# Altium schematic sheet Sheet1.SchDoc
size A4
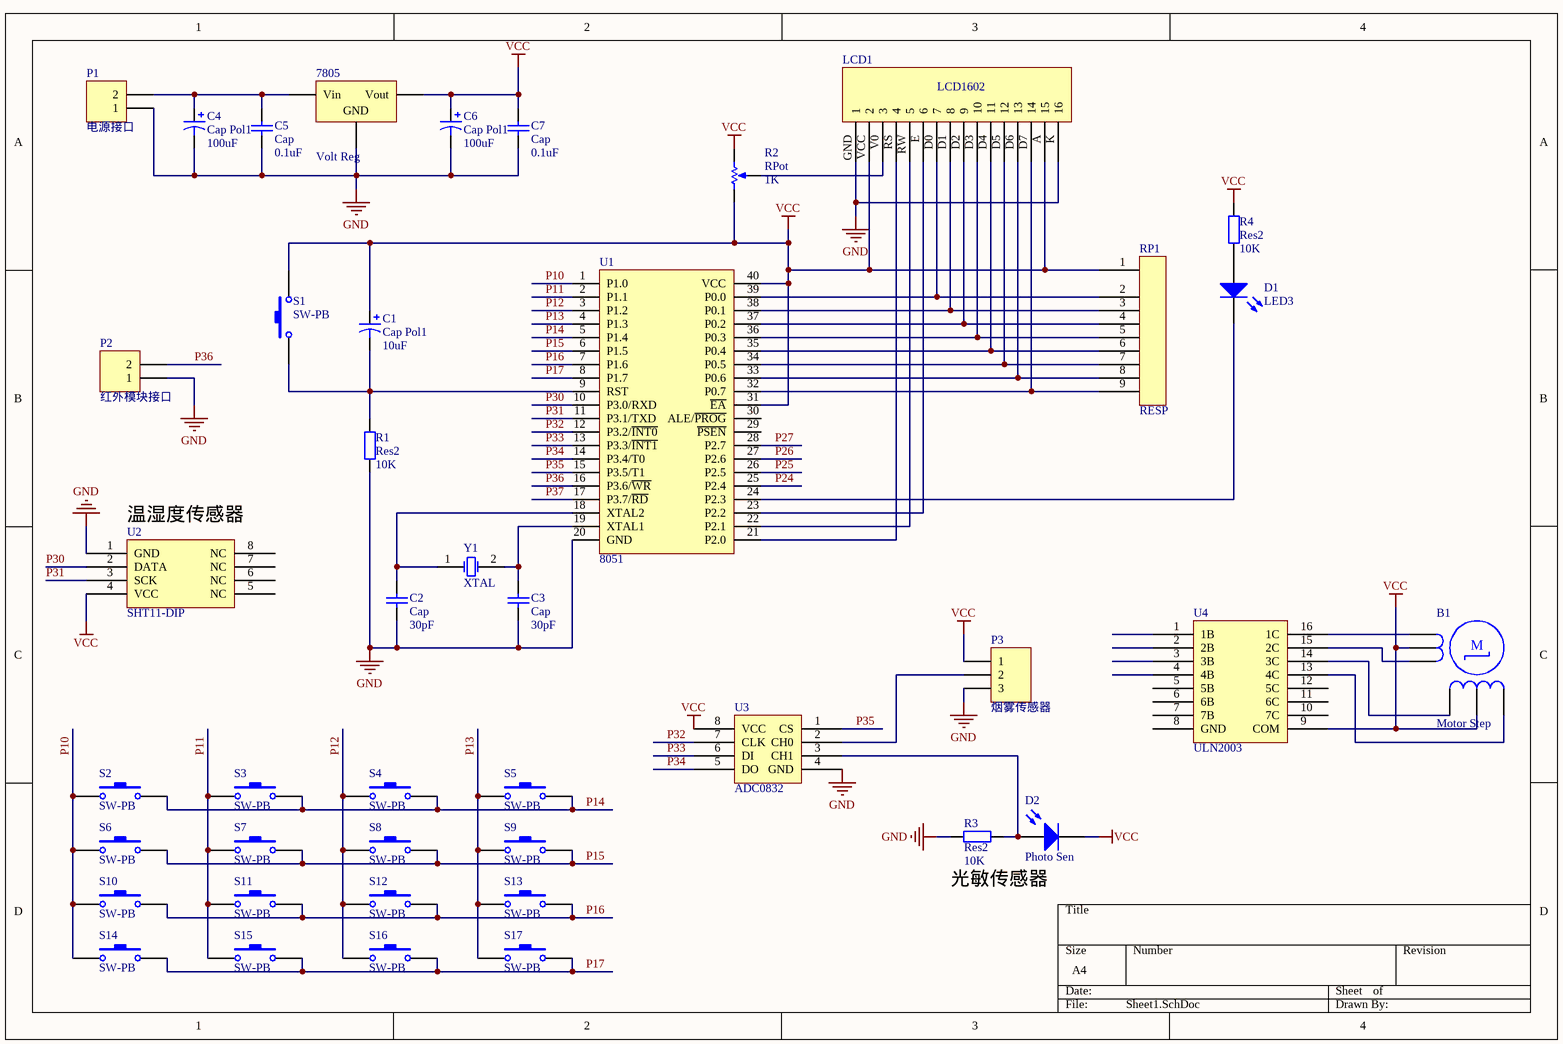
[diagram p0: Sheet1.SchDoc]

## Parts
7805  Volt Reg  [D2PAK_N]
B1  Motor Step  [DIP-6]
C1  Cap Pol1  value 10uF  [RB7.6-15]
C2  Cap  value 30pF  [RAD-0.3]
C3  Cap  value 30pF  [RAD-0.3]
C4  Cap Pol1  value 100uF  [RB7.6-15]
C5  Cap  value 0.1uF  [RAD-0.3]
C6  Cap Pol1  value 100uF  [RB7.6-15]
C7  Cap  value 0.1uF  [RAD-0.3]
D1  LED3  [3.5X2.8X1.9]
D2  Photo Sen  [PIN2]
LCD1  (no value)
P1  电源接口  [HDR1X2]
P2  红外模块接口  [HDR1X2]
P3  烟雾传感器  [HDR1X3]
R1  Res2  value 10K  [AXIAL-0.4]
R2  RPot  value 1K  [VR5]
R3  Res2  value 10K  [AXIAL-0.4]
R4  Res2  value 10K  [AXIAL-0.4]
RP1  RESP
S1  SW-PB  [SPST-2]
S2  SW-PB  [SPST-2]
S3  SW-PB  [SPST-2]
S4  SW-PB  [SPST-2]
S5  SW-PB  [SPST-2]
S6  SW-PB  [SPST-2]
S7  SW-PB  [SPST-2]
S8  SW-PB  [SPST-2]
S9  SW-PB  [SPST-2]
S10  SW-PB  [SPST-2]
S11  SW-PB  [SPST-2]
S12  SW-PB  [SPST-2]
S13  SW-PB  [SPST-2]
S14  SW-PB  [SPST-2]
S15  SW-PB  [SPST-2]
S16  SW-PB  [SPST-2]
S17  SW-PB  [SPST-2]
U1  8051
U2  SHT11-DIP
U3  ADC0832
U4  ULN2003
Y1  XTAL  [R38]

## Nets
GND: 7805.2(GND) C2.1 C3.1 C4.2 C5.1 C6.2 C7.1 LCD1.GND(1) LCD1.K(16) P1.1 P2.1 P3.3 R1.1 R3.2 U1.20(GND) U2.1(GND) U3.4(GND)
VCC: 7805.3(Vout) B1.2 B1.5 C1.1 C6.1 C7.2 D2.2(K) LCD1.A(15) LCD1.VCC(2) P3.1 R2.1(TOP) R2.2(BOT) R4.2 RP1.1 S1.2 U1.31(~{EA}) U1.40(VCC) U2.4(VCC) U3.8(VCC) U4.9(COM)
P10: S2.1 S6.1 S10.1 S14.1 U1.1(P1.0)
P11: S3.1 S7.1 S11.1 S15.1 U1.2(P1.1)
P12: S4.1 S8.1 S12.1 S16.1 U1.3(P1.2)
P13: S5.1 S9.1 S13.1 S17.1 U1.4(P1.3)
P14: S2.2 S3.2 S4.2 S5.2 U1.5(P1.4)
P15: S6.2 S7.2 S8.2 S9.2 U1.6(P1.5)
P16: S10.2 S11.2 S12.2 S13.2 U1.7(P1.6)
P17: S14.2 S15.2 S16.2 S17.2 U1.8(P1.7)
P24: U1.25(P2.4)
P25: U1.26(P2.5)
P26: U1.27(P2.6)
P27: U1.28(P2.7)
P30: U1.10(P3.0/RXD) U2.2(DATA)
P31: U1.11(P3.1/TXD) U2.3(SCK)
P32: U1.12(P3.2/~{INT0}) U3.7(CLK)
P33: U1.13(P3.3/~{INT1}) U3.6(DI)
P34: U1.14(P3.4/T0) U3.5(DO)
P35: U1.15(P3.5/T1) U3.1(CS)
P36: P2.2 U1.16(P3.6/~{WR})
P37: U1.17(P3.7/~{RD})
Net7805_1: 7805.1(Vin) C4.1 C5.2 P1.2
NetB1_1: B1.1 U4.16(1C)
NetB1_3: B1.3 U4.15(2C)
NetB1_4: B1.4 U4.14(3C)
NetB1_6: B1.6 U4.13(4C)
NetC1_2: C1.2 R1.2 S1.1 U1.9(RST)
NetC2_2: C2.2 U1.18(XTAL2) Y1.1(OSC1)
NetC3_2: C3.2 U1.19(XTAL1) Y1.2(OSC2)
NetD1_1: D1.1(A) R4.1
NetD1_2: D1.2(K) U1.24(P2.3)
NetD2_1: D2.1(A) R3.1 U3.3(CH1)
NetLCD1_D0: LCD1.D0(7) RP1.2 U1.39(P0.0)
NetLCD1_D1: LCD1.D1(8) RP1.3 U1.38(P0.1)
NetLCD1_D2: LCD1.D2(9) RP1.4 U1.37(P0.2)
NetLCD1_D3: LCD1.D3(10) RP1.5 U1.36(P0.3)
NetLCD1_D4: LCD1.D4(11) RP1.6 U1.35(P0.4)
NetLCD1_D5: LCD1.D5(12) RP1.7 U1.34(P0.5)
NetLCD1_D6: LCD1.D6(13) RP1.8 U1.33(P0.6)
NetLCD1_D7: LCD1.D7(14) RP1.9 U1.32(P0.7)
NetLCD1_E: LCD1.E(6) U1.23(P2.2)
NetLCD1_RS: LCD1.RS(4) U1.21(P2.0)
NetLCD1_RW: LCD1.RW(5) U1.22(P2.1)
NetLCD1_V0: LCD1.V0(3) R2.3(TAP)
NetP3_2: P3.2 U3.2(CH0)

Not connected (* = marked no-connect by the designer): U1 29(~{PSEN}) 30(ALE/~{PROG}); U2 5(NC) 6(NC) 7(NC) 8(NC); U4 1(1B) 2(2B) 3(3B) 4(4B) 5(5B) 6(6B) 7(7B) 8(GND) 10(7C) 11(6C) 12(5C)

## Notes on the sheet
- (near U2) 温湿度传感器
- (near R3) 光敏传感器
- (in symbol Motor Step) M

## Library data of the parts
7805 = Volt Reg: Voltage Regulator; Published: 24-Mar-1999; LatestRevisionDate: 29-May-2009; LatestRevisionNote: IPC-7351 Footprint Added.; PackageReference: D2PAK; Publisher: Altium Limited; PackageDescription: 3-Pin Transistor Outline Package 2.54 mm Pitch, 15.1 mm Lead Span
B1 = Motor Step: Motor Stepper; Published: 24-Mar-1999; LatestRevisionDate: 17-Jul-2002; LatestRevisionNote: Re-released for DXP Platform.; PackageReference: DIP-6; Publisher: Altium Limited; Code_JEDEC: MO-001-AM
C1 C4 C6 = Cap Pol1: Polarized Capacitor (Radial); Published: 8-Jun-2000; LatestRevisionDate: 17-Jul-2002; LatestRevisionNote: Re-released for DXP Platform.; PackageReference: RB7.6-15; Publisher: Altium Limited; PackageDescription: Polarized Capacitor (Radial); 2 Leads
C2 C3 C5 C7 = Cap: Capacitor; Published: 8-Jun-2000; LatestRevisionDate: 17-Jul-2002; LatestRevisionNote: Re-released for DXP Platform.; PackageReference: RAD-0.3; Publisher: Altium Limited; PackageDescription: Radial Cap, Thru-Hole; 2 Leads; 0.3 in Pin Spacing
D1 = LED3: Typical BLUE SiC LED; Published: 8-Jun-2000; LatestRevisionDate: 17-Dec-2003; LatestRevisionNote: PCB Footprint replaced.; DatasheetVersion: 16-Apr-2002; PackageVersion: 16-Apr-2002; PackageReference: 3.5X2.8X1.9; Publisher: Altium Limited; PackageDescription: SM LED; 2 C-Bend Leads; Body 3.5 x 2.8 x 1.9 mm, inc leads (LxWxH typ)
D2 = Photo Sen: Photosensitive Diode; Published: 24-Mar-1999; LatestRevisionDate: 17-Jul-2002; LatestRevisionNote: Re-released for DXP Platform.; PackageReference: PIN2; Publisher: Altium Limited
LCD1 = LCD1602
P1 P2 = Header 2: Header, 2-Pin; LatestRevisionDate: 17-Jul-2002; LatestRevisionNote: Re-released for DXP Platform.; Publisher: Altium Limited
P3 = Header 3: Header, 3-Pin; LatestRevisionDate: 17-Jul-2002; LatestRevisionNote: Re-released for DXP Platform.; Publisher: Altium Limited
R1 R3 R4 = Res2: Resistor; Published: 8-Jun-2000; LatestRevisionDate: 17-Jul-2002; LatestRevisionNote: Re-released for DXP Platform.; PackageReference: AXIAL-0.4; Publisher: Altium Limited; PackageDescription: Axial Device, Thru-Hole; 2 Leads; 0.4 in Pin Spacing
R2 = RPot: Potentiometer; Sim Note: Enter the Resistance value and the set point into parameter fields.; Set Position: 0.5; Published: 8-Jun-2000; LatestRevisionDate: 17-Jul-2002; LatestRevisionNote: Re-released for DXP Platform.; PackageReference: VR5; Publisher: Altium Limited; PackageDescription: Variable Resistor, Thru-Hole; 3 Leads
S1-S17 = SW-PB: Switch; Published: 24-Mar-1999; LatestRevisionDate: 17-Jul-2002; LatestRevisionNote: Re-released for DXP Platform.; PackageReference: SPST-2; Publisher: Altium Limited; PackageDescription: Switch; 2 Leads
Y1 = XTAL: Crystal Oscillator; Published: 8-Jun-2000; LatestRevisionDate: 17-Jul-2002; LatestRevisionNote: Re-released for DXP Platform.; PackageReference: R38; Publisher: Altium Limited; PackageDescription: Crystal, Thru-Hole; 2 Leads; Body 3.1 x 8.2 mm (Dia.xH)